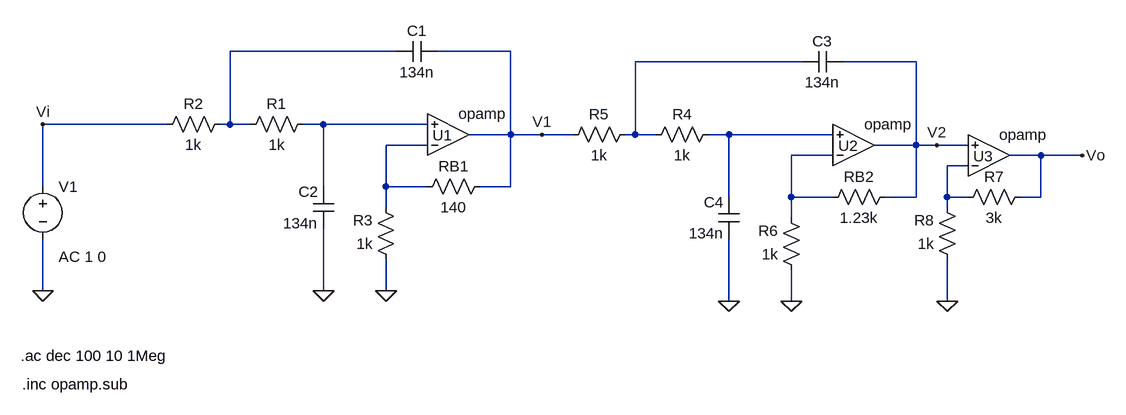
[diagram p0: schematic Ej_3c.asc]
Ej_3c.asc, the LTspice schematic file:
Version 4
SHEET 1 1232 680
WIRE 128 80 -128 80
WIRE 304 80 192 80
WIRE 752 96 496 96
WIRE 928 96 816 96
WIRE -224 192 -416 192
WIRE -128 192 -128 80
WIRE -128 192 -144 192
WIRE -96 192 -128 192
WIRE 16 192 -16 192
WIRE 176 192 16 192
WIRE 304 208 304 80
WIRE 304 208 240 208
WIRE 352 208 304 208
WIRE 400 208 352 208
WIRE 496 208 496 96
WIRE 496 208 480 208
WIRE 528 208 496 208
WIRE 640 208 608 208
WIRE 800 208 640 208
WIRE 176 224 112 224
WIRE 928 224 928 96
WIRE 928 224 864 224
WIRE 960 224 928 224
WIRE 1008 224 960 224
WIRE 800 240 736 240
WIRE 1120 240 1072 240
WIRE 1184 240 1120 240
WIRE 1008 256 976 256
WIRE -416 288 -416 192
WIRE 16 288 16 192
WIRE 112 288 112 224
WIRE 176 288 112 288
WIRE 304 288 304 208
WIRE 304 288 256 288
WIRE 640 304 640 208
WIRE 736 304 736 240
WIRE 800 304 736 304
WIRE 928 304 928 224
WIRE 928 304 880 304
WIRE 976 304 976 256
WIRE 1008 304 976 304
WIRE 1120 304 1120 240
WIRE 1120 304 1088 304
WIRE 112 320 112 288
WIRE 976 320 976 304
WIRE 736 336 736 304
WIRE -416 448 -416 368
WIRE 16 448 16 352
WIRE 112 448 112 400
WIRE 640 464 640 368
WIRE 736 464 736 416
WIRE 976 464 976 400
FLAG 112 448 0
FLAG 16 448 0
FLAG 736 464 0
FLAG 640 464 0
FLAG 976 464 0
FLAG 1184 240 Vo
FLAG 352 208 V1
FLAG 960 224 V2
FLAG -416 192 Vi
FLAG -416 448 0
SYMBOL OpAmps\\opamp 208 272 M180
WINDOW 0 -24 63 Left 2
SYMATTR InstName U1
SYMBOL cap 192 64 R90
WINDOW 0 0 32 VBottom 2
WINDOW 3 32 32 VTop 2
SYMATTR InstName C1
SYMATTR Value 134n
SYMBOL cap 32 352 R180
WINDOW 0 24 56 Left 2
WINDOW 3 24 8 Left 2
SYMATTR InstName C2
SYMATTR Value 134n
SYMBOL res 0 176 R90
WINDOW 0 0 56 VBottom 2
WINDOW 3 32 56 VTop 2
SYMATTR InstName R1
SYMATTR Value 1k
SYMBOL res -128 176 R90
WINDOW 0 0 56 VBottom 2
WINDOW 3 32 56 VTop 2
SYMATTR InstName R2
SYMATTR Value 1k
SYMBOL res 128 416 R180
WINDOW 0 36 76 Left 2
WINDOW 3 36 40 Left 2
SYMATTR InstName R3
SYMATTR Value 1k
SYMBOL res 160 304 R270
WINDOW 0 32 56 VTop 2
WINDOW 3 0 56 VBottom 2
SYMATTR InstName RB1
SYMATTR Value 140
SYMBOL OpAmps\\opamp 832 288 M180
WINDOW 0 -24 63 Left 2
SYMATTR InstName U2
SYMBOL cap 816 80 R90
WINDOW 0 0 32 VBottom 2
WINDOW 3 32 32 VTop 2
SYMATTR InstName C3
SYMATTR Value 134n
SYMBOL cap 656 368 R180
WINDOW 0 24 56 Left 2
WINDOW 3 24 8 Left 2
SYMATTR InstName C4
SYMATTR Value 134n
SYMBOL res 624 192 R90
WINDOW 0 0 56 VBottom 2
WINDOW 3 32 56 VTop 2
SYMATTR InstName R4
SYMATTR Value 1k
SYMBOL res 496 192 R90
WINDOW 0 0 56 VBottom 2
WINDOW 3 32 56 VTop 2
SYMATTR InstName R5
SYMATTR Value 1k
SYMBOL res 752 432 R180
WINDOW 0 36 76 Left 2
WINDOW 3 36 40 Left 2
SYMATTR InstName R6
SYMATTR Value 1k
SYMBOL res 784 320 R270
WINDOW 0 32 56 VTop 2
WINDOW 3 0 56 VBottom 2
SYMATTR InstName RB2
SYMATTR Value 1.23k
SYMBOL OpAmps\\opamp 1040 304 M180
WINDOW 0 -24 63 Left 2
SYMATTR InstName U3
SYMBOL res 1104 288 R90
WINDOW 0 0 56 VBottom 2
WINDOW 3 32 56 VTop 2
SYMATTR InstName R7
SYMATTR Value 3k
SYMBOL res 992 416 R180
WINDOW 0 36 76 Left 2
WINDOW 3 36 40 Left 2
SYMATTR InstName R8
SYMATTR Value 1k
SYMBOL voltage -416 272 R0
WINDOW 123 24 124 Left 2
WINDOW 39 0 0 Left 0
SYMATTR InstName V1
SYMATTR Value ""
SYMATTR Value2 AC 1 0
TEXT -450 548 Left 2 !.ac dec 100 10 1Meg
TEXT -448 592 Left 2 !.inc opamp.sub

The netlist it stands for:
* Ej_3c.asc
XU1 N005 N003 V1 opamp Aol=100K GBW=10Meg  ; pins invin noninvin out
C1 V1 N001 134n
C2 0 N003 134n
R1 N003 N001 1k
R2 N001 Vi 1k
R3 0 N005 1k
RB1 N005 V1 140
XU2 N006 N004 V2 opamp Aol=100K GBW=10Meg  ; pins invin noninvin out
C3 V2 N002 134n
C4 0 N004 134n
R4 N004 N002 1k
R5 N002 V1 1k
R6 0 N006 1k
RB2 N006 V2 1.23k
XU3 N007 V2 Vo opamp Aol=100K GBW=10Meg  ; pins invin noninvin out
R7 Vo N007 3k
R8 0 N007 1k
V1 Vi 0 AC 1 0
.ac dec 100 10 1Meg
.inc opamp.sub
.backanno
.end